# EasyEDA Pro project ProPrj_MambaQuad_2026-04-23.epro, board FC V1 Melted
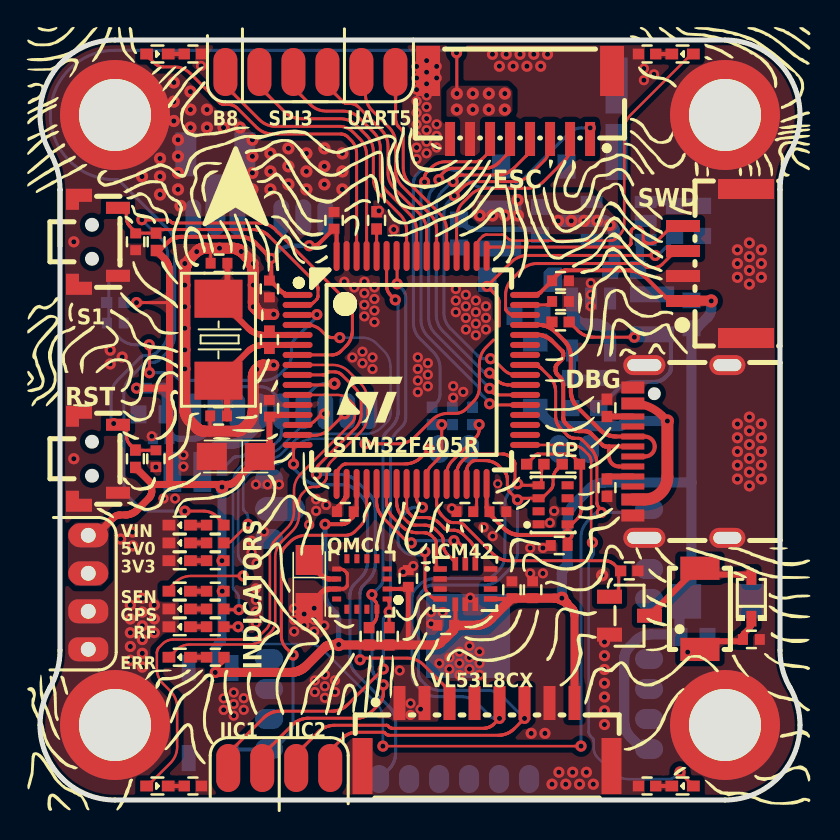
[diagram p14: board, top side]
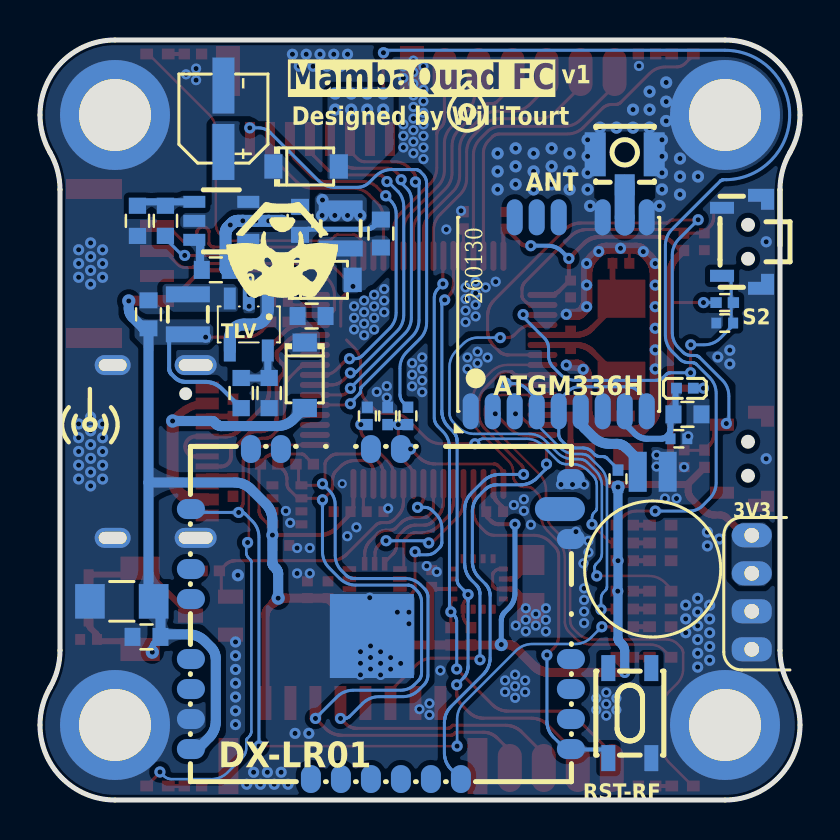
[diagram p15: board, bottom side, seen from below]

Outline 38 x 38 mm; copper layers: Top Layer, Bottom Layer. Coordinates in mm from the lower left corner of the outline.
Outline path: 1,30.52 arc(0.87,31.48) 0.5,32.38 arc(0.13,33.28) 0,34.25 arc(1.1,36.9) 3.75,38 34.25,38 arc(36.9,36.9) 38,34.25 arc(37.87,33.28) 37.5,32.38 arc(37.13,31.48) 37,30.52 37,7.48 arc(37.13,6.52) 37.5,5.62 arc(37.87,4.72) 38,3.75 arc(36.9,1.1) 34.25,0 3.75,0 arc(1.1,1.1) 0,3.75 arc(0.13,4.72) 0.5,5.62 arc(0.87,6.52) 1,7.48 1,30.52 ; 1,30.52 1,27.71
Stack: Top Layer 0.035mm / Dielectric1 1.51mm FR4 er 4.5 / Bottom Layer 0.035mm

## Design rules (mm)
net SWCLK: DP2
net SWDIO: DP2
net USB_DEBUG_DP: DP1
net USB_DEBUG_DM: DP1
spacing copperThickness1oz (default): track to track 0.102, other pairs 0.152 to 0.3
spacing copperThickness2oz: track to track 0.203, other pairs 0.152 to 0.3
track width copperThickness1oz (default): min 0.102, default 0.203, max 2.54
track width copperThickness2oz: min 0.203, default 0.254, max 2.54
differential pair differentialPair (default): width min 0.127, default 0.254, max 2.54; gap min 0.152, default 0.152
net GND uses copperRegion
net 3V3 uses copperRegion
net $1N129 uses copperRegion
net 5V uses copperRegion
net $1N278 uses copperRegion
net VIN uses copperRegion
net $1N122 uses copperRegion
net $1N120 uses copperRegion

## Placement (name value [footprint] x y rotation side)
3V3  -  [LED0402]  6.99 11.97 0 top
5V0  -  [LED0402]  6.99 12.85 0 top
ANT  3GHz  [ANT-SMD_3P-L3.0-W2.6]  8.76 31.52 0 bottom
ATGM336H  ATGM336H-6N-74  [COMM-SMD_18P-L10.1-W9.7-P1.1-TL_L76-LB]  12.06 24.28 90 bottom
BUZ  DET402  [BUZ-SMD_L4.0-W3.0-LS4.5-FD]  33 9.56 90 top
C1  100nF  [C0402]  18.41 11.08 270 top
C2  4.7uF  [CASE-A_3216]  13.46 10.8 270 top
C3  2.2uF  [C0402]  24.63 10.51 270 top
C4  100nF  [C0402]  23.6 10.51 270 top
C5  100nF  [C0603]  32.67 8.16 180 bottom
C6  1uF  [C0402]  5.79 17.06 270 top
C7  100nF  [C0402]  14.7 28.98 270 top
C8  100nF  [C0402]  11.47 25.55 90 top
C9  100nF  [C0402]  26.03 25.96 180 top
C10  100nF  [C0402]  15.27 14.42 0 top
C11  100nF  [C0402]  22.9 14.42 180 top
C12  22pF  [C0402]  8.93 19.2 180 top
C13  22pF  [C0402]  8.95 26.84 180 top
C14  1uF  [CASE-A_3216]  9.79 17.17 180 top
C15  100nF  [C0402]  11.47 19.58 270 top
C16  2.2uF  [C0402]  26.03 24.93 180 top
C17  2.2uF  [C0402]  21.24 14.42 0 top
C18  100nF  [C0402]  25.96 12.73 0 top
C19  100uF  [C1206]  33.91 9.93 180 bottom
C21  10uF  [C0603]  25 28.96 90 bottom
C22  22uF  [C0603]  20.96 28.32 270 bottom
C23  100nF  [C0603]  29.21 26.51 180 bottom
C24  10uF  [CAP-SMD_BD4.0-L4.3-W4.3-LS5.0-FD]  28.83 34.06 90 bottom
C25  4.7uF  [C0603]  24.42 24.2 0 bottom
C26  10uF  [C0603]  32.57 24.28 270 bottom
C27  1uF  [C0402]  4.78 27.91 270 top
C28  1uF  [C0402]  3.76 23.85 0 bottom
C29  100nF  [C0402]  35.57 8.03 180 top
C30  10uF  [C0603]  5.63 19.28 0 bottom
C31  0.22F  [CAP-TH_DMS3R3224]  7.37 16.41 90 bottom
C32  100nF  [C0402]  6.06 18.06 0 bottom
C33  10nF  [C0402]  20.29 8.73 0 top
D1  1N5819W  [SOD-123_L2.7-W1.6-LS3.7-RD]  24.69 31.68 180 bottom
D2  1N5819W  [SOD-123_L2.7-W1.6-LS3.7-RD]  24.76 21.24 270 bottom
D3  1N5819W  [SOD-123_L2.7-W1.6-LS3.7-RD#2]  24 26.01 180 bottom
D4  1N4148WS  [SOD-323_L1.7-W1.3-LS2.5-FD]  35.57 10.11 270 top
DBG  Type-C-TOP_1  [USB-C-SMD_TYPE-C16PIN]  32 17.43 90 top
DX-LR01  DX-LR01-433T22S  [WIRELM-SMD_DX-LR01-433T22S]  20.96 9.3 270 bottom
ERR  -  [LED0402]  6.99 7.14 0 top
ESC  WAFER-SH1.0-8PWB  [CONN-SMD_8P-P1.00_XUNPU_WAFER-SH1.0-8PWB]  24 34.75 180 top
GPS  -  [LED0402]  6.99 9.55 0 top
H2  -  [HDR-TH_6P-P2.54-V-F]  15.62 36.4 0 top
H4  -  [HDR-TH_4P-P2.54-V-F]  2.41 9.42 270 top
ICM42  ICM-42688-P  [LGA-14_L3.0-W2.5-P0.50-TL]  21.27 10.8 0 top
ICP  ICP-10111  [LGA-8_L2.5-W2.0-P0.65_AMP6127]  25.65 14.76 180 top
L1  2.2uH  [IND-SMD_L2.5-W2.0_MHCHL2520]  22.97 28.58 270 bottom
L2  2.2uH  [IND-SMD_L2.5-W2.0_MHCHL2520]  30.61 24.28 270 bottom
L3  BLM15PX121SN1D  [L0402]  5.75 20.59 180 bottom
LF  -  [LED0402]  5.87 37.3 180 top
LR  -  [LED0402]  5.87 0.7 180 top
NOREF  -  [Pad_e2]  34.25 34.25 0 top
NOREF#2  -  [Pad_e3]  34.25 3.75 270 top
NOREF#3  -  [Pad_e4]  3.75 3.75 180 top
NOREF#4  -  [Pad_e1]  3.75 34.25 0 top
NOREF#5  -  [HDR-TH_4P-P2.54-V-F#2]  13.22 1.6 0 top
Q1  AO3400  [SOT-23-3_L2.9-W1.3-P1.90-LS2.4-BL-2]  29.47 9.22 270 top
QMC  QMC5883P  [LGA-16_L3.0-W3.0-P0.50-BL_SQ]  16.09 10.8 90 top
R1  4.7K  [R0402]  16.45 8.19 270 top
R5  10K  [R0402]  17.47 8.19 270 top
R6  10K  [R0402]  21.63 19.2 90 bottom
R7  5.1K  [R0402]  28.35 19.61 90 top
R8  10K  [R0402]  4.77 17.06 270 top
R9  1M  [R0402]  11.47 23.01 270 top
R10  4.7K  [R0402]  26.54 16.79 0 top
R11  4.7K  [R0402]  24.76 16.79 180 top
R12  220K  [R0603]  31.73 28.96 270 bottom
R13  40.2K  [R0603]  33.13 28.96 90 bottom
R14  100K  [R0603]  26.54 20.35 90 bottom
R15  2K  [R0402]  8.76 13.74 180 top
R16  453K  [R0603]  27.94 20.35 270 bottom
R17  590Ω  [R0402]  8.76 12.85 0 top
R18  330Ω  [R0402]  8.76 11.97 180 top
R19  1.5K  [R0402]  26.03 23.9 180 top
R20  UNKNOWN  [R0402]  19.6 19.2 270 bottom
R21  UNKNOWN  [R0402]  20.62 19.2 90 bottom
R22  330Ω  [R0402]  8.76 8.66 180 top
R23  330Ω  [R0402]  30.35 0.7 180 top
R24  330Ω  [R0402]  30.35 37.3 180 top
R25  330Ω  [R0402]  7.65 0.7 0 top
R26  330Ω  [R0402]  7.65 37.3 0 top
R27  330Ω  [R0402]  8.76 7.14 0 top
R28  330Ω  [R0402]  8.76 10.44 0 top
R29  10K  [R0402]  5.81 27.91 90 top
R30  10K  [R0402]  3.76 24.87 180 bottom
R31  10K  [R0402]  29.46 11.46 0 top
R35  10K  [R0402]  16.83 28.98 90 top
R36  0Ω  [R0402]  9.1 16.06 270 bottom
R37  1K  [R0402]  8.76 9.55 180 top
R38  5.1K  [R0402]  28.35 15.62 90 top
RF  -  [LED0402]  6.99 8.66 0 top
RF#2  -  [LED0402]  32.13 37.3 0 top
RR  -  [LED0402]  32.13 0.7 0 top
RST  HX TS24CA-H3.8 160gf  [SW-SMD_TS24CA]  2.92 17.06 90 top
RST-RF  K2-1808SN-A3SW-01  [SW-SMD_4P-L4.2-W3.3-P2.15-LS5.1]  8.51 4.34 270 bottom
S1  HX TS24CA-H3.8 160gf  [SW-SMD_TS24CA]  2.92 27.91 90 top
S2  HX TS24CA-H3.8 160gf  [SW-SMD_TS24CA]  2.92 27.91 270 bottom
SEN  -  [LED0402]  6.99 10.44 0 top
STM32F405R  STM32F405RGT6  [LQFP-64_L10.0-W10.0-P0.50-LS12.0-BL]  18.57 21.5 270 top
SWD  WAFER-GH1.25-4PWB  [CONN-SMD_4P-P1.25_XUNPU_WAFER-GH1.25-4PWB]  33.73 26.82 90 top
TLV  TLV62568DBVR  [SOT-23-5_L3.0-W1.7-P0.95-LS2.8-BR]  27.56 23.78 90 bottom
TPS  TPS563201DDCR  [SOT-23-6_L2.9-W1.6-P0.95-LS2.8-BR]  28.94 28.96 180 bottom
VIN  -  [LED0402]  6.99 13.74 0 top
VL53L8CX  WAFER-GH1.25-8PWB  [CONN-SMD_8P-P1.25_XUNPU-WAFER-GH1.25-8PWB]  22.35 3.27 0 top
X1  8MHz  [CRYSTAL-SMD_L5.0-W3.2]  8.92 23.01 90 top

## Footprints (pads in the part's own frame, mm; a bottom-side part is the same pattern mirrored in y, then rotated)
ANT-SMD_3P-L3.0-W2.6
  rect 1x1.05 smd: 1(0,0.762)
  rect 1.05x2.2 smd: 2(-1.475,-0.762) 3(1.475,-0.762)
BUZ-SMD_L4.0-W3.0-LS4.5-FD
  rect 1.16x1.96 smd: 1(-2.03,0) 2(2.03,0)
C0402
  rect 0.5x0.54 smd: 1(-0.42,0) 2(0.42,0)
C0603
  rect 0.8x0.9 smd: 1(-0.7,0) 2(0.7,0)
C1206
  rect 1.485x1.728 smd: 1(-1.593,0) 2(1.593,0)
CAP-SMD_BD4.0-L4.3-W4.3-LS5.0-FD
  rect 2.8x1.1 smd: 1(-1.661,0) 2(1.661,0)
CAP-TH_DMS3R3224
  rect 2x0.9 smd: 1(-0.002,0.75) 2(0.002,-0.75)
CASE-A_3216
  rect 1.5x1.359 smd: 1(-1.2,0) 2(1.2,0)
COMM-SMD_18P-L10.1-W9.7-P1.1-TL_L76-LB
  custom 1.8x0.8 smd: 1(-4.85,4.4) 2(-4.85,3.3) 3(-4.85,2.2) 4(-4.85,1.1) 5(-4.85,0) 6(-4.85,-1.1) 7(-4.85,-2.2) 8(-4.85,-3.3) 9(-4.85,-4.4) 10(4.85,-4.4) 11(4.85,-3.3) 12(4.85,-2.2) 14(4.85,0) 15(4.85,1.1) 16(4.85,2.2)
CONN-SMD_4P-P1.25_XUNPU_WAFER-GH1.25-4PWB
  rect 0.6x1.7 smd: 1(-1.875,1.575) 2(-0.625,1.575) 3(0.625,1.575) 4(1.875,1.575)
  rect 1x2.8 smd: 5(3.725,-1.575) 6(-3.725,-1.575)
CONN-SMD_8P-P1.00_XUNPU_WAFER-SH1.0-8PWB
  rect 0.5x1.7 smd: 1(-3.5,1.7) 2(-2.5,1.7) 3(-1.5,1.7) 4(-0.5,1.7) 5(0.5,1.7) 6(1.5,1.7) 7(2.5,1.7) 8(3.5,1.7)
  rect 1.2x2.5 smd: 9(4.6,-1.7) 10(-4.6,-1.7)
CONN-SMD_8P-P1.25_XUNPU-WAFER-GH1.25-8PWB
  rect 0.6x1.7 smd: 1(-4.375,1.575) 2(-3.126,1.575) 3(-1.875,1.575) 4(-0.625,1.575) 5(0.625,1.575) 6(1.875,1.575) 7(3.125,1.575) 8(4.375,1.575)
  rect 1x2.8 smd: 10(6.225,-1.575) 11(-6.225,-1.575)
CRYSTAL-SMD_L5.0-W3.2
  rect 1.9x2.4 smd: 1(-2.05,0) 2(2.05,0)
HDR-TH_4P-P2.54-V-F
  oval 1.2x2 hole 0.74: 1(-3.81,0) 2(-1.91,0)
  rrect 1.2x2 hole 0.74: 3(-0.01,0) 4(1.89,0)
HDR-TH_4P-P2.54-V-F#2
  oval 1.2x2.4 smd: 1(-3.81,0) 2(-2.11,0) 3(-0.41,0) 4(1.29,0)
HDR-TH_6P-P2.54-V-F
  oval 1.2x2.4 smd: 1(-6.35,0) 2(-4.65,0) 3(-2.95,0) 4(-1.25,0) 5(0.45,0) 6(2.15,0)
IND-SMD_L2.5-W2.0_MHCHL2520
  rect 0.8x2.2 smd: 1(-1,0) 2(1,0)
L0402
  rect 0.54x0.54 smd: 1(-0.42,0) 2(0.42,0)
LED0402
  rect 0.637x0.541 smd: 1(-0.538,0) 2(0.538,0)
LGA-8_L2.5-W2.0-P0.65_AMP6127
  rect 0.6x0.4 smd: 1(0.725,0.975) 2(0.725,0.325) 3(0.725,-0.325) 4(0.725,-0.975) 5(-0.725,-0.975) 6(-0.725,-0.325) 7(-0.725,0.325) 8(-0.725,0.975)
LGA-14_L3.0-W2.5-P0.50-TL
  rect 0.675x0.28 smd: 1(-1.262,0.75) 2(-1.262,0.25) 3(-1.262,-0.25) 4(-1.262,-0.75) 8(1.262,-0.75) 9(1.262,-0.25) 10(1.262,0.25) 11(1.262,0.75)
  rect 0.28x0.675 smd: 5(-0.5,-1.012) 6(0,-1.012) 7(0.5,-1.012) 12(0.5,1.012) 13(0,1.012) 14(-0.5,1.012)
LGA-16_L3.0-W3.0-P0.50-BL_SQ
  rect 0.25x0.45 smd: 1(-0.75,-1.263) 2(-0.25,-1.263) 3(0.25,-1.263) 4(0.75,-1.263) 9(0.75,1.263) 10(0.25,1.263) 11(-0.25,1.263) 12(-0.75,1.263)
  rect 0.45x0.25 smd: 5(1.263,-0.75) 6(1.263,-0.25) 7(1.263,0.25) 8(1.263,0.75) 13(-1.263,0.75) 14(-1.263,0.25) 15(-1.263,-0.25) 16(-1.263,-0.75)
LQFP-64_L10.0-W10.0-P0.50-LS12.0-BL
  oval 0.3x1.5 smd: 1(-3.75,-5.688) 2(-3.25,-5.688) 3(-2.75,-5.688) 4(-2.25,-5.688) 5(-1.75,-5.688) 6(-1.25,-5.688) 7(-0.75,-5.688) 8(-0.25,-5.688) 9(0.25,-5.688) 10(0.75,-5.688) 11(1.25,-5.688) 12(1.75,-5.688) 13(2.25,-5.688) 14(2.75,-5.688) 15(3.25,-5.688) 16(3.75,-5.688) 33(3.75,5.688) 34(3.25,5.688) 35(2.75,5.688) 36(2.25,5.688) 37(1.75,5.688) 38(1.25,5.688) 39(0.75,5.688) 40(0.25,5.688) 41(-0.25,5.688) 42(-0.75,5.688) 43(-1.25,5.688) 44(-1.75,5.688) 45(-2.25,5.688) 46(-2.75,5.688) 47(-3.25,5.688) 48(-3.75,5.688)
  oval 1.5x0.3 smd: 17(5.7,-3.738) 18(5.7,-3.238) 19(5.7,-2.738) 20(5.7,-2.238) 21(5.7,-1.738) 22(5.7,-1.238) 23(5.7,-0.739) 24(5.7,-0.238) 25(5.7,0.262) 26(5.7,0.762) 27(5.7,1.262) 28(5.7,1.762) 29(5.7,2.261) 30(5.7,2.762) 31(5.7,3.261) 32(5.7,3.762) 49(-5.7,3.762) 50(-5.7,3.261) 51(-5.7,2.762) 52(-5.7,2.261) 53(-5.7,1.762) 54(-5.7,1.262) 55(-5.7,0.762) 56(-5.7,0.262) 57(-5.7,-0.238) 58(-5.7,-0.739) 59(-5.7,-1.238) 60(-5.7,-1.738) 61(-5.7,-2.238) 62(-5.7,-2.738) 63(-5.7,-3.238) 64(-5.7,-3.738)
Pad_e1
  round 5.5 hole 3.6: 1(0,0)
Pad_e2
  round 5.5 hole 3.6: 1(0,0)
Pad_e3
  round 5.5 hole 3.6: 1(0,0)
Pad_e4
  round 5.5 hole 3.6: 1(0,0)
R0402
  rect 0.566x0.54 smd: 1(-0.433,0) 2(0.433,0)
R0603
  rect 0.806x0.864 smd: 1(-0.753,0) 2(0.753,0)
SOD-123_L2.7-W1.6-LS3.7-RD
  rect 0.91x1.22 smd: 1(-1.635,0) 2(1.635,0)
SOD-123_L2.7-W1.6-LS3.7-RD#2
  custom 0.91x1.22 smd: 1(-1.635,0)
  rect 0.91x1.22 smd: 2(1.635,0)
SOD-323_L1.7-W1.3-LS2.5-FD
  rect 0.78x0.5 smd: 1(-1.04,0) 2(1.04,0)
SOT-23-3_L2.9-W1.3-P1.90-LS2.4-BL-2
  rect 0.7x1.25 smd: 1(-0.95,-1) 2(0.95,-1) 3(0,1)
SOT-23-5_L3.0-W1.7-P0.95-LS2.8-BR
  rect 1.1x0.6 smd: 1(1.3,-0.95) 2(1.3,0) 3(1.3,0.95) 4(-1.3,0.95) 5(-1.3,-0.95)
SOT-23-6_L2.9-W1.6-P0.95-LS2.8-BR
  rect 1.1x0.6 smd: 1(1.35,-0.95) 2(1.35,0) 3(1.35,0.95) 4(-1.35,0.95) 5(-1.35,0) 6(-1.35,-0.95)
SW-SMD_4P-L4.2-W3.3-P2.15-LS5.1
  rect 1.3x0.7 smd: 1(-2.25,1.075) 2(2.25,1.075) 3(-2.25,-1.075) 4(2.25,-1.075)
SW-SMD_TS24CA
  custom 1.05x1.3 smd: 1(-2.125,0.975) 2(2.125,0.975)
  rect 0.6x1.2 smd: 3(-1.7,-0.975) 4(1.7,-0.975)
USB-C-SMD_TYPE-C16PIN
  oval 1x2.1 hole 0.6x1.7: 1(-4.32,1.788) 2(4.32,1.788)
  oval 1x1.8 hole 0.6x1.4: 3(-4.32,-2.362) 4(4.32,-2.362)
  rect 0.6x1.15 smd: A1B12(-3.2,2.362) A4B9(-2.4,2.362) B1A12(3.2,2.362) B4A9(2.4,2.362)
  rect 0.3x1.15 smd: A5(-1.25,2.362) A6(-0.25,2.362) A7(0.25,2.362) A8(1.25,2.362) B5(1.75,2.362) B6(0.75,2.362) B7(-0.75,2.362) B8(-1.75,2.362)
WIRELM-SMD_DX-LR01-433T22S
  oval 1.4x1 smd: 2(-8.25,1) 3(-8.25,-0.5) 6(-8.25,-5) 7(-8.25,-6.5) 16(8.25,-3.5) 17(8.25,-2) 18(8.25,-0.5) 19(8.25,1) 20(8.25,2.5) 21(8.25,4)
  oval 1x1.4 smd: 8(-5.25,-9.5) 10(-2.25,-9.5) 11(-0.75,-9.5) 12(2.25,-9.5) 13(3.75,-9.5) 14(5.25,-9.5) 15(6.75,-9.5) 22(6.75,9.5) 23(5.25,9.5) 24(3.75,9.5) 25(2.25,9.5) 28(-3.75,9.5) 30(-6.75,9.5)
  oval 1.2x2.5 smd: 29(-5.25,8.95)
  rect 4.2x4.2 smd: 31(1.1,-0.45)

## Nets
3V3: BUZ.1 C1.2 C3.2 C4.2 C5.2 C7.2 C8.2 C9.2 C10.2 C11.2 C14.1 C15.2 C18.2 C19.2 C26.2 C29.2 C33.2 D4.2 DX-LR01.15 H4.1 H4.2 ICM42.5 ICM42.8 ICP.8 L2.2 L3.2 QMC.2 R1.2 R5.2 R8.2 R10.2 R11.2 R16.2 R18.1 R19.1 R27.2 R28.2 R29.1 R30.1 R36.2 STM32F405R.1 STM32F405R.13 STM32F405R.19 STM32F405R.32 STM32F405R.48 STM32F405R.64 SWD.1 VL53L8CX.8
5V: C22.2 D3.2 L1.2 R12.2 R17.2
5V_USB: D2.2 DBG.A4B9 DBG.B4A9
GND: 3V3.1 5V0.1 ANT.2 ANT.3 ATGM336H.1 ATGM336H.10 ATGM336H.12 C1.1 C2.2 C3.1 C4.1 C5.1 C6.2 C7.1 C8.1 C9.1 C10.1 C11.1 C12.2 C13.2 C14.2 C15.1 C16.1 C17.1 C18.1 C19.1 C21.1 C22.1 C24.2 C25.1 C26.1 C27.2 C28.2 C29.1 C30.1 C31.2 C32.1 C33.1 DBG.1 DBG.2 DBG.3 DBG.4 DBG.A1B12 DBG.B1A12 DX-LR01.14 DX-LR01.28 DX-LR01.30 DX-LR01.31 ESC.8 ESC.9 ESC.10 GPS.1 H4.3 H4.4 ICM42.2 ICM42.3 ICM42.6 ICM42.7 ICM42.10 ICM42.11 ICP.1 ICP.7 NOREF.1 NOREF#2.1 NOREF#3.1 NOREF#4.1 Q1.2 QMC.9 QMC.11 R6.2 R7.2 R13.1 R14.1 R21.2 R23.2 R24.2 R25.2 R26.2 R31.2 R35.2 R38.1 RF.1 RST.1 RST.2 RST.3 RST-RF.2 S1.1 S1.2 S1.3 S2.1 S2.2 S2.3 STM32F405R.12 STM32F405R.18 STM32F405R.63 SWD.2 SWD.5 SWD.6 TLV.2 TPS.1 VIN.1 VL53L8CX.1 VL53L8CX.2 VL53L8CX.7 VL53L8CX.10 VL53L8CX.11
VIN: D1.2 ESC.7 R15.1
ADC1_IN8: R20.2 R21.1 STM32F405R.26
BUZ: Q1.1 R31.1 STM32F405R.27
DSHOT_M1: ESC.6 STM32F405R.37
DSHOT_M2: ESC.5 STM32F405R.38
DSHOT_M3: ESC.4 STM32F405R.39
DSHOT_M4: ESC.3 STM32F405R.40
ESC_CURR: ESC.1 R20.1
ESC_TX: ESC.2 STM32F405R.52
EX_PB8: H2.1 STM32F405R.61
EX_SPI3_MISO: H2.3 STM32F405R.56
EX_SPI3_MOSI: H2.2 STM32F405R.57
EX_SPI3_SCK: H2.4 STM32F405R.55
EX_UART5_RX: H2.5 STM32F405R.54
EX_UART5_TX: H2.6 STM32F405R.53
GPIO_EXTI2: ATGM336H.4 R37.1 STM32F405R.10
GPIO_EXTI5: ICM42.4 STM32F405R.25
GPIO_EXTI8: DX-LR01.8 R22.1 STM32F405R.41
GPIO_EXTI13: C27.1 R29.2 S1.4 STM32F405R.2
GPIO_EXTI14: C28.1 R30.2 S2.4 STM32F405R.3
GPS_RX: ATGM336H.3 STM32F405R.14
GPS_TX: ATGM336H.2 STM32F405R.15
I2C1_SCL: NOREF#5.1 QMC.1 R5.1 STM32F405R.58
I2C1_SDA: NOREF#5.2 QMC.16 R1.1 STM32F405R.59
I2C2_SCL: ICP.4 NOREF#5.3 R11.1 STM32F405R.29 VL53L8CX.5
I2C2_SDA: ICP.3 NOREF#5.4 R10.1 STM32F405R.30 VL53L8CX.6
ICM42688P_CS: ICM42.12 STM32F405R.24
ICM42688P_SCK: ICM42.13 STM32F405R.21
ICM42688P_SDI: ICM42.14 STM32F405R.23
ICM42688P_SDO: ICM42.1 STM32F405R.22
LED_ERR: ERR.1 STM32F405R.8
LED_LF: LF.2 STM32F405R.62
LED_LR: LR.2 STM32F405R.11
LED_RF: RF#2.2 STM32F405R.50
LED_RR: RR.2 STM32F405R.33
LED_STATUS: SEN.1 STM32F405R.4
LORA_RST: DX-LR01.22 RST-RF.4 STM32F405R.20
LORA_RX: DX-LR01.21 STM32F405R.16
LORA_TX: DX-LR01.2 STM32F405R.17
OSC_IN: C13.1 R9.1 STM32F405R.5 X1.2
OSC_OUT: C12.1 R9.2 STM32F405R.6 X1.1
PC1: STM32F405R.9 VL53L8CX.3
RST: C6.1 R8.1 RST.4 STM32F405R.7
SPI2_MISO: STM32F405R.35
SPI2_MOSI: STM32F405R.36
SPI2_SCK: STM32F405R.34
SWCLK: STM32F405R.49 SWD.4
SWDIO: STM32F405R.46 SWD.3
USART1_RX: STM32F405R.43
USART1_TX: STM32F405R.42
USART3_TX: STM32F405R.51
USB_DEBUG_DM: DBG.A7 DBG.B7 STM32F405R.44
USB_DEBUG_DP: DBG.A6 DBG.B6 R19.2 STM32F405R.45
$1N19: C2.1 QMC.10
$1N83: C16.2 STM32F405R.47
$1N84: C17.2 STM32F405R.31
$1N102: R6.1 STM32F405R.28
$1N103: R35.1 STM32F405R.60
$1N118: R12.1 R13.2 TPS.4
$1N120: C21.2 C24.1 D1.1 TPS.3 TPS.5
$1N121: C23.1 TPS.6
$1N122: C23.2 L1.1 TPS.2
$1N125: R15.2 VIN.2
$1N127: R14.2 R16.1 TLV.5
$1N129: L2.1 TLV.3
$1N138: 5V0.2 R17.1
$1N141: 3V3.2 R18.2
$1N278: C25.2 D2.1 D3.1 TLV.1 TLV.4
$1N282: DBG.A5 R38.2
$1N283: DBG.B5 R7.1
$1N318: R22.2 RF.2
$1N356: BUZ.2 D4.1 Q1.3
$1N367: GPS.2 R37.2
$1N371: ANT.1 ATGM336H.11
$1N378: ATGM336H.6 C31.1
$1N390: ATGM336H.5 ATGM336H.9 R36.1
$1N391: ATGM336H.8 C30.2 C32.2 L3.1
$1N445: R28.1 SEN.2
$1N446: ERR.2 R27.1
$1N450: LF.1 R26.1
$1N451: LR.1 R25.1
$1N452: R24.1 RF#2.1
$1N453: R23.1 RR.1

Pads without a net: ATGM336H 7 14 15 16; DBG A8 B8; DX-LR01 3 6 7 10 11 12 13 16 17 18 19 20 23 24 25 29; ICM42 9; ICP 2 5 6; QMC 3 4 5 6 7 8 12 13 14 15; RST-RF 1 3; VL53L8CX 4

## Via types
v1: diameter 0.66, hole 0.254, Top Layer to Bottom Layer, 6 vias
v2: diameter 0.559, hole 0.254, Top Layer to Bottom Layer, 149 vias
v3: diameter 0.61, hole 0.254, Top Layer to Bottom Layer, 60 vias
v4: diameter 0.508, hole 0.254, Top Layer to Bottom Layer, 146 vias
v5: diameter 0.457, hole 0.254, Top Layer to Bottom Layer, 1 via

## Routing (per net, layer and track width the routed paths; a pad name or vN(x,y) marks a point on that pad's centre or on a via; arc(x,y) is an arc through that point)
3V3: length 159.6
  Top Layer w0.152: 8.78,6.51 8.78,6.51 ; 26.34,17.3 26.38,17.29 26.39,17.29 26.43,17.28 26.44,17.28 26.47,17.27 26.52,17.25 26.53,17.25 26.58,17.23 26.6,17.21 26.62,17.2 26.66,17.17 26.68,17.16 ; 24.92,17.3 26.28,17.3 26.32,17.3 ; 26.42,13.78 26.42,13.78 ; 26.61,13.82 26.62,13.82 ; 27.04,16.72 27.04,16.72 ; 26.41,13.78 26.41,13.78 ; 8.76,6.46 8.77,6.47 ; 27.05,14.46 27.05,14.5 27.05,16.68 ; 26.55,13.79 26.56,13.79 ; v2(29.72,23.14) 27.7,23.14 27.61,23.14 27.59,23.15 27.52,23.16 27.5,23.16 27.43,23.17 27.41,23.18 27.35,23.2 27.33,23.2 27.26,23.23 27.24,23.23 27.18,23.26 27.16,23.27 27.1,23.31 27.08,23.32 27.04,23.35 27.02,23.36 27.01,23.37 26.96,23.41 26.94,23.43 26.89,23.48 R19.1 ; 9.18,6.93 9.17,6.92 ; 26.64,13.84 26.65,13.84 ; 24.9,17.3 24.89,17.3 ; 27.05,14.45 27.04,14.41 27.04,14.4 27.03,14.36 27.02,14.31 27.01,14.27 27,14.26 26.99,14.23 26.96,14.18 26.94,14.14 26.93,14.13 26.91,14.11 ; 26.65,13.85 26.87,14.07 26.9,14.1 ; 26.5,13.78 26.51,13.78 ; 9.2,7.02 9.2,7.01 ; 9.19,6.98 9.19,6.97 ; 24.82,17.27 24.81,17.27 ; 27.05,16.7 27.05,16.69 ; 26.43,13.78 26.49,13.78 ; 9.14,6.86 9.13,6.86 ; 6.48,24.86 6.47,24.87 ; 24.69,17.15 24.69,17.15 ; 26.95,16.89 26.73,17.11 26.7,17.14 ; 27.04,16.71 27.05,16.71 ; 8.77,6.48 8.77,6.48 ; 27.05,16.7 27.05,16.7 ; 26.98,16.81 26.98,16.83 ; 8.8,6.53 9.13,6.85 ; 24.79,17.25 24.78,17.25 ; 8.79,6.52 8.8,6.52 ; 27.03,16.73 27.04,16.73 ; 26.38,13.75 26.38,13.75 ; 24.87,17.29 24.86,17.29 ; 26.51,13.78 26.52,13.79 ; 26.96,16.88 26.96,16.88 ; 24.77,17.23 24.69,17.16 ; R27.2 9.2,7.03 ; 8.79,6.51 8.79,6.52 ; 26.39,13.76 26.39,13.76 ; v2(4.83,24.87) 6.47,24.87 ; 24.91,17.3 24.92,17.3 ; 26.4,13.77 26.4,13.77 ; 8.76,6.41 8.76,6.44 ; 9.19,6.96 9.19,6.95 ; 26.98,16.84 26.97,16.84 ; 26.6,13.81 26.61,13.81 ; 24.88,17.3 24.88,17.29 ; 8.76,6.45 8.76,6.46 ; 27.03,16.74 27.03,16.73 ; 26.38,13.75 26.38,13.74 ; 8.78,6.5 8.78,6.5 ; 9.18,6.94 9.18,6.94 ; 24.85,17.29 24.84,17.28 ; 9.19,7 9.19,6.99 ; 9.17,6.91 9.16,6.9 ; 26.4,13.78 26.41,13.78 ; 26.57,13.8 26.57,13.8 ; 24.83,17.28 24.83,17.28 ; 9.15,6.88 9.14,6.87 ; 8.77,6.49 8.78,6.49 ; 8.76,6.44 8.76,6.45 ; 26.53,13.79 26.54,13.79 ; 26.39,13.77 26.39,13.76 ; R11.2 24.68,17.14 ; 27.05,16.69 27.05,16.69 ; 26.99,16.78 27.02,16.75 ; 24.8,17.27 24.8,17.26 ; 27.04,16.72 27.04,16.72 ; 26.58,13.8 26.59,13.81 ; 8.77,6.47 8.77,6.47 ; 24.78,17.25 24.77,17.24 ; 9.16,6.9 9.15,6.89 ; 26.63,13.83 26.64,13.84
  Top Layer w0.196: 25,25.36 25.01,25.37 ; 24.86,25.31 24.87,25.31 ; 24.84,25.31 24.85,25.31 ; 24.65,25.27 24.66,25.27 ; 24.96,25.34 24.97,25.34 ; STM32F405R.48 24.6,25.25 ; 24.61,25.25 24.62,25.25 ; 24.71,25.31 24.82,25.31 ; 24.94,25.33 24.95,25.33 ; 24.92,25.32 24.93,25.32 ; 24.9,25.31 24.91,25.32 ; 24.66,25.28 24.68,25.29 ; 24.88,25.31 24.89,25.31 ; 24.98,25.35 24.99,25.36 ; 25.59,25.94 25.03,25.39 ; 25.02,25.38 25.03,25.38
  Top Layer w0.203: C33.2 20.74,8.76 ; 26.37,13.25 24,13.25 23.91,13.25 23.89,13.26 23.83,13.26 23.8,13.27 23.74,13.28 23.72,13.29 23.65,13.31 23.63,13.31 23.57,13.34 23.55,13.34 23.49,13.37 23.47,13.38 23.41,13.42 23.39,13.43 23.34,13.46 23.31,13.48 23.26,13.52 23.24,13.54 23.19,13.59 22.51,14.26 ; 11.56,26.11 11.56,26.11 ; 18.36,10.6 18.35,10.59 ; 5.91,27.48 5.92,27.48 ; 22.51,14.27 22.51,14.27 ; 5.85,27.48 5.9,27.48 ; 22.33,14.64 22.33,14.65 ; 22.48,14.33 22.48,14.33 ; 22.36,14.55 22.36,14.56 ; 22.34,14.62 22.33,14.63 ; 22.35,14.58 22.34,14.59 ; 11.53,26.03 11.53,26.03 ; 22.38,14.52 22.38,14.53 ; 20.75,8.78 20.75,8.79 ; 18.35,10.59 18.34,10.58 ; 13.71,27.72 13.73,27.72 ; 15.31,13.85 15.33,13.86 ; 15.35,13.87 15.37,13.89 15.4,13.9 ; 15.8,14.54 15.8,14.54 ; 15.79,14.53 15.8,14.53 ; 15.83,14.62 15.83,14.62 ; 15.69,14.38 15.69,14.37 ; 22.33,14.67 STM32F405R.32 ; 15.61,14.12 15.44,13.94 15.41,13.92 ; 15.13,13.79 15.15,13.8 ; 15.71,14.44 15.72,14.45 ; 18.31,10.57 18.31,10.56 ; 14.82,28.53 14.83,28.52 ; 6.02,27.52 6.03,27.52 ; 15.82,14.58 15.82,14.59 ; 5.92,27.48 5.93,27.48 ; 13.7,27.71 13.66,27.71 v2(13.46,27.71) ; 15.24,13.82 15.26,13.83 ; 15.69,14.4 15.69,14.4 ; 15.81,14.55 15.81,14.55 ; 20.76,8.8 20.76,8.8 ; 18.25,10.55 18.25,10.55 ; 14.83,28.5 STM32F405R.64 ; 15.67,14.21 15.67,14.2 ; 11.49,25.97 11.51,25.97 ; 14.82,28.54 14.82,28.53 ; 20.76,8.8 20.76,8.81 ; 18.3,10.56 18.3,10.56 ; 11.54,26.06 11.55,26.06 ; 22.48,14.35 22.48,14.35 ; 22.5,14.28 22.5,14.27 ; 6.05,27.54 6.39,27.88 6.43,27.92 6.45,27.93 6.49,27.97 6.51,27.98 6.55,28.01 6.57,28.02 6.62,28.05 6.63,28.06 6.69,28.08 6.7,28.09 6.75,28.11 6.77,28.11 6.83,28.13 6.84,28.13 6.9,28.14 6.92,28.15 6.97,28.15 6.99,28.15 7.07,28.16 10,28.16 10.08,28.15 10.1,28.15 10.16,28.15 10.18,28.14 10.25,28.13 10.28,28.12 10.34,28.11 10.36,28.1 10.43,28.08 10.45,28.07 10.51,28.04 10.53,28.03 10.59,28 10.61,27.99 10.66,27.95 10.68,27.94 10.73,27.89 10.75,27.88 10.81,27.82 11.25,27.39 11.3,27.33 11.32,27.31 11.34,27.28 11.36,27.25 11.39,27.2 11.41,27.18 11.42,27.17 11.44,27.13 11.45,27.1 11.47,27.06 11.48,27.05 11.5,26.97 11.51,26.95 11.53,26.89 11.53,26.87 11.54,26.81 11.55,26.79 11.55,26.73 11.55,26.71 11.56,26.64 11.56,26.12 ; 20.76,8.82 20.77,8.82 ; 14.26,13.79 15.08,13.79 15.11,13.79 ; 15.69,14.36 15.69,14.3 ; 6.03,27.53 6.04,27.53 ; 22.35,14.57 22.35,14.58 ; 15.66,14.19 15.66,14.18 ; v2(14.25,13.79) 14.26,13.79 ; 14.8,28.56 14.8,28.55 ; 13.85,27.76 13.84,27.75 ; 25.62,26.02 25.87,26.28 25.9,26.31 25.91,26.32 25.95,26.34 25.96,26.35 25.99,26.38 26,26.38 26.05,26.41 26.09,26.43 26.14,26.45 26.16,26.45 26.2,26.46 26.21,26.47 26.25,26.47 26.26,26.48 26.31,26.48 26.32,26.48 26.38,26.48 29.45,26.48 29.53,26.48 29.55,26.48 29.61,26.47 29.63,26.47 29.66,26.47 29.71,26.46 29.73,26.45 29.79,26.43 29.81,26.43 29.88,26.4 29.9,26.4 29.96,26.37 29.98,26.36 30.04,26.33 30.06,26.31 30.11,26.28 30.13,26.26 30.19,26.22 30.2,26.21 30.27,26.15 31.25,25.17 31.28,25.13 31.3,25.12 31.33,25.1 31.34,25.09 31.39,25.06 31.43,25.03 31.44,25.03 31.49,25 31.53,24.99 31.55,24.98 31.59,24.97 31.6,24.97 31.65,24.96 31.66,24.96 31.7,24.95 31.72,24.95 31.77,24.95 31.79,24.95 32.15,24.95 ; 15.63,14.13 15.63,14.14 ; 14.81,28.55 14.81,28.55 ; 15.69,14.29 15.69,14.28 ; 13.91,27.79 13.9,27.78 ; 25.61,25.98 25.61,26 ; 22.48,14.32 22.48,14.32 ; 22.39,14.51 22.39,14.52 ; 22.5,14.28 22.5,14.28 ; 15.66,14.18 15.65,14.17 ; 11.52,26.02 11.52,26.03 ; 11.49,25.99 11.51,26.02 ; 20.76,8.79 20.76,8.79 ; 15.81,14.56 15.82,14.56 ; 13.95,27.82 13.97,27.84 14.67,28.54 ; 22.33,14.65 22.33,14.66 ; 15.82,14.57 15.82,14.57 ; 14.73,28.56 14.76,28.56 ; 22.48,14.31 22.48,14.31 ; 14.77,28.56 14.78,28.56 ; 5.97,27.49 5.98,27.49 ; 15.69,14.39 15.69,14.39 ; 14.78,28.56 14.78,28.56 ; STM32F405R.1 12.54,25.25 12.49,25.25 12.46,25.26 12.41,25.26 12.38,25.27 12.35,25.28 12.31,25.29 12.26,25.31 12.2,25.33 12.16,25.36 12.13,25.38 12.12,25.39 12.08,25.42 12.07,25.42 12.03,25.46 11.53,25.97 ; 15.68,14.23 15.68,14.22 ; 15.28,13.83 15.3,13.84 ; 15.69,14.37 15.69,14.37 ; 15.7,14.41 15.7,14.42 ; ICM42.8 23.56,10.05 ; 15.83,14.63 STM32F405R.19 ; C11.2 22.48,14.36 ; 18.39,10.63 18.36,10.6 ; 22.48,14.34 22.48,14.34 ; 20.77,8.83 ICM42.5 ; 15.21,13.81 15.22,13.81 ; 14.81,28.54 14.82,28.54 ; 15.68,14.25 15.68,14.24 ; 11.53,26.04 11.54,26.04 ; 18.24,10.55 QMC.2 ; v3(26.38,13.25) 26.38,13.25 ; v3(26.38,13.25) 26.38,13.73 ; v3(26.38,13.25) C18.2 ; 15.7,14.42 15.7,14.43 ; 14.79,28.56 14.79,28.56 ; 13.82,27.74 13.81,27.74 ; 18.32,10.57 18.32,10.57 ; 15.83,14.59 15.83,14.6 ; 18.34,10.58 18.33,10.58 ; 15.69,14.41 15.69,14.41 ; 18.28,10.55 18.27,10.55 ; 6.01,27.51 6.02,27.51 ; 22.49,14.29 22.49,14.29 ; 11.55,26.07 11.55,26.07 ; 15.73,14.46 15.78,14.51 ; 6,27.5 6,27.5 ; 20.76,8.81 20.76,8.81 ; 22.48,14.42 22.4,14.5 ; 15.72,14.45 15.72,14.45 ; 13.79,27.73 13.78,27.73 ; 15.17,13.8 15.19,13.8 ; 14.83,28.52 14.83,28.51 ; 20.74,8.77 20.75,8.78 ; 5.94,27.48 5.95,27.48 ; 22.37,14.54 22.37,14.54 ; 13.76,27.72 13.75,27.72 ; 14.72,28.56 14.72,28.56 ; 20.75,8.78 20.75,8.78 ; 22.49,14.3 22.49,14.3 ; 15.83,14.61 15.83,14.61 ; 5.95,27.48 5.96,27.49 ; 22.34,14.6 22.34,14.61 ; 11.55,26.09 11.55,26.09 ; 15.78,14.52 15.79,14.52 ; 15.71,14.43 15.71,14.44 ; 11.54,26.05 11.54,26.05 ; 18.29,10.56 18.28,10.56 ; 15.62,14.13 15.62,14.12 ; 15.68,14.27 15.68,14.26 ; 13.94,27.81 13.92,27.8 ; 15.65,14.16 15.64,14.15 ; 13.88,27.77 13.87,27.76 ; 14.83,28.51 14.83,28.51 ; 18.27,10.55 18.26,10.55 ; 11.55,26.08 11.55,26.08 ; 11.56,26.1 11.56,26.1 ; 5.98,27.49 5.99,27.5 ; 14.68,28.55 14.68,28.54
  Top Layer w0.254: 18.41,10.62 18.41,7.75
  Top Layer w0.299: 11.47,19.14 11.47,19.14 ; 11.62,19.25 STM32F405R.13 ; 11.54,19.23 11.54,19.23 ; 11.57,19.24 11.57,19.25 ; 11.6,19.25 11.6,19.25 ; 11.61,19.25 11.61,19.25 ; 11.59,19.25 11.59,19.25 ; 11.56,19.24 11.56,19.24 ; 11.52,19.22 11.53,19.22 ; C14.1 11.24,17.42 11.26,17.45 11.3,17.49 11.33,17.52 11.34,17.53 11.36,17.57 11.39,17.62 11.41,17.67 11.43,17.73 11.44,17.74 11.45,17.8 11.46,17.84 11.46,17.85 11.47,17.89 11.47,17.91 11.47,17.96 11.47,19.13 ; 11.55,19.23 11.55,19.24 ; 11.58,19.25 11.58,19.25 ; 11.49,19.19 11.52,19.21 ; 11.53,19.22 11.53,19.23
  Top Layer w0.305: 35.16,8.23 35.16,8.24 ; 35.56,8.76 35.55,8.74 ; 35.5,8.62 35.5,8.64 ; 35.16,8.25 35.17,8.26 ; 35.48,8.6 35.49,8.61 ; 35.08,7.96 35.08,7.96 ; 35.15,8.06 35.15,8.17 ; 35.21,8.33 35.21,8.33 ; 35.15,8.2 35.15,8.21 ; D4.2 35.57,8.86 35.57,8.83 ; 33.25,7.78 33.21,7.74 33.21,7.74 BUZ.1 ; 35.01,7.94 35.01,7.94 ; 35.47,8.59 35.45,8.57 35.22,8.34 ; 35,7.94 33.67,7.94 33.63,7.94 ; 35.15,8.22 35.16,8.22 ; 35.13,8.01 35.1,7.98 ; 35.17,8.27 35.17,8.27 ; 35.15,8.05 35.15,8.05 ; 35.51,8.65 35.52,8.67 ; 35.06,7.95 35.05,7.95 ; 35.19,8.31 35.19,8.3 ; 35.03,7.94 35.03,7.94 ; 35.09,7.97 35.09,7.97 ; 33.61,7.94 33.56,7.93 33.52,7.92 33.48,7.91 33.46,7.9 33.43,7.89 33.39,7.87 33.34,7.85 33.33,7.84 33.28,7.81 33.26,7.79 ; 35.07,7.96 35.07,7.96 ; 35.06,7.95 35.06,7.95 ; 35.1,7.98 35.09,7.97 ; 35.57,8.82 35.57,8.81 ; 35.2,8.32 35.2,8.31 ; 35.18,8.28 35.18,8.29 ; 35.55,8.73 35.54,8.71 ; 35.02,7.94 35.02,7.94 ; 35.56,8.79 35.56,8.77 ; 35.04,7.95 35.04,7.94 ; 35.54,8.7 35.53,8.68 ; 35.15,8.18 35.15,8.19
  Top Layer w0.355: 5.53,15.22 5.54,15.24 ; 9.64,15.84 9.61,15.83 9.58,15.82 ; 5.59,15.4 5.58,15.36 5.58,15.34 ; 3.7,14.14 3.72,14.15 ; 5.49,15.15 5.5,15.17 ; 5.84,27.44 6.19,27.09 6.23,27.05 6.24,27.03 6.28,26.99 6.29,26.97 6.32,26.92 6.33,26.91 6.36,26.86 6.37,26.84 6.4,26.79 6.4,26.77 6.42,26.72 6.43,26.7 6.45,26.64 6.45,26.62 6.46,26.57 6.47,26.55 6.47,26.49 6.47,26.47 6.48,26.39 6.48,20.6 ; 2.89,13.34 2.91,13.36 3.67,14.11 3.69,14.13 ; 6.48,15.78 9.12,15.78 ; 6.48,15.78 5.63,15.78 ; 6.48,15.78 6.48,20.6 ; 9.12,15.78 9.11,15.76 ; 9.12,15.78 9.38,15.78 9.41,15.78 ; 3.86,14.23 3.88,14.23 ; 9.66,15.86 9.68,15.87 9.71,15.89 ; 2.84,13.3 2.85,13.31 ; 2.69,13.24 2.71,13.24 ; 2.72,13.25 2.74,13.25 ; 2.66,13.24 2.67,13.24 ; 9.43,15.78 9.45,15.78 ; 3.76,14.18 3.78,14.19 ; 9.72,15.9 9.75,15.93 C14.1 ; 5.63,15.78 5.61,15.75 ; 5.63,15.78 4.77,16.63 ; 3.9,14.24 3.92,14.24 ; 6.48,20.6 6.47,20.6 ; 5.47,15.12 5.48,15.13 ; 3.79,14.2 3.81,14.21 ; 5.46,15.11 5.43,15.08 4.86,14.51 4.81,14.46 4.77,14.42 4.75,14.41 4.71,14.39 4.7,14.38 4.65,14.35 4.64,14.34 4.59,14.32 4.57,14.32 4.53,14.3 4.51,14.29 4.46,14.28 4.44,14.27 4.4,14.26 4.38,14.26 4.33,14.25 4.31,14.25 4.25,14.25 4,14.25 3.97,14.25 ; 5.57,15.31 5.56,15.28 5.55,15.26 ; 2.78,13.27 2.8,13.28 ; H4.1 2.62,13.23 2.65,13.24 ; 3.83,14.22 3.85,14.22 ; 9.47,15.78 9.49,15.79 ; 5.59,15.71 5.59,15.45 5.59,15.41 ; 9.55,15.8 9.57,15.81 ; 3.73,14.16 3.75,14.17 ; 9.51,15.79 9.53,15.8 ; v1(9.1,15.65) 9.1,15.74 ; 2.75,13.26 2.77,13.26 ; 3.94,14.25 3.96,14.25 ; 5.51,15.18 5.53,15.2 ; 2.87,13.32 2.88,13.33 ; 2.81,13.28 2.83,13.29 ; v2(4.83,20.59) 6.46,20.59
  Top Layer w0.406: 26.73,9.27 26.73,9.23 VL53L8CX.8 ; 26.36,9.82 26.38,9.81 26.57,9.62 26.59,9.59 ; 26.6,9.58 26.62,9.55 26.63,9.54 26.65,9.52 26.65,9.51 26.67,9.48 26.68,9.44 26.7,9.4 26.71,9.37 ; 26.71,9.35 26.72,9.32 26.72,9.29
  Top Layer w0.457: 19.74,7.75 19.71,7.75 18.41,7.75 R5.2 R1.2 14.97,7.75 ; 20.04,7.88 20.06,7.9 20.24,8.07 ; 23.58,10.07 23.56,10.05 22.58,9.07 22.51,9.01 22.49,9 22.44,8.95 22.42,8.94 22.37,8.91 22.35,8.89 22.29,8.86 22.27,8.85 22.21,8.82 22.19,8.81 22.12,8.79 22.1,8.78 22.04,8.77 22.01,8.76 21.94,8.75 21.92,8.74 21.86,8.74 21.84,8.74 21.76,8.73 C33.2 20.71,8.62 ; 14.94,7.77 14.95,7.76 ; 20.64,8.44 20.28,8.09 ; 19.91,7.79 19.93,7.8 ; 20.68,8.5 20.67,8.49 ; 14.25,7.64 14.28,7.66 14.31,7.68 14.32,7.69 14.36,7.71 14.39,7.72 14.4,7.73 14.44,7.75 14.49,7.76 14.52,7.77 14.54,7.77 14.57,7.77 ; 20.71,8.61 20.71,8.6 ; 14.59,7.77 14.62,7.77 14.65,7.77 14.93,7.77 ; 19.84,7.77 19.85,7.77 ; 26.36,9.82 26.32,9.86 26.26,9.9 26.24,9.92 26.21,9.94 26.19,9.95 26.18,9.96 26.14,9.98 26.11,9.99 26.06,10.02 25.99,10.04 25.98,10.05 25.92,10.06 25.9,10.07 25.84,10.08 25.83,10.08 25.77,10.09 25.75,10.09 25.68,10.09 C3.2 23.62,10.09 ; 20.69,8.54 20.69,8.53 ; 19.98,7.83 20,7.85 20.03,7.86 ; 20.7,8.57 20.7,8.56 ; 20.7,8.55 20.7,8.55 ; 20.71,8.59 20.7,8.58 ; 19.87,7.78 19.89,7.79 ; 20.67,8.49 20.66,8.48 ; 14.23,7.63 14.2,7.6 13.32,6.72 13.25,6.66 13.24,6.64 13.18,6.6 13.17,6.59 13.11,6.55 13.09,6.54 13.03,6.5 13.01,6.49 12.95,6.47 12.93,6.46 12.87,6.44 12.85,6.43 12.78,6.41 12.76,6.41 12.71,6.4 12.69,6.39 12.67,6.39 12.6,6.38 12.58,6.38 12.5,6.38 8.79,6.38 ; 20.66,8.47 20.65,8.46 ; 20.69,8.52 20.68,8.51 ; 19.8,7.76 19.82,7.76 ; 19.76,7.75 19.78,7.76 ; 19.94,7.81 19.96,7.82 ; 20.26,8.08 20.27,8.08 ; 20.65,8.46 20.64,8.45
  Top Layer w0.508: 32.16,24.96 32.15,24.95 ; v1(33.56,24.95) 33.56,24.96 ; 32.17,24.96 33.54,24.96
  Bottom Layer w0.152: R30.1 v2(4.83,24.87)
  Bottom Layer w0.203: v2(13.46,27.71) 12.62,27.71 ; R16.2 28.9,20.56 ; 31.03,20.97 31.05,20.98 ; 31.52,21.43 31.52,21.45 ; 31.49,21.37 31.49,21.39 ; 29.7,20.91 29.66,20.9 ; 29.75,20.91 30.69,20.91 ; 31.19,21.07 31.21,21.08 ; 31.14,21.03 31.16,21.04 ; 29.01,20.65 29.03,20.67 ; 29.31,20.83 29.35,20.84 ; 31.28,21.15 31.41,21.28 ; 30.97,20.95 31,20.96 ; 31.5,21.4 31.51,21.42 ; 31.54,22.89 31.54,22.91 ; 12.57,27.71 12.54,27.71 ; 30.74,20.91 30.76,20.91 ; 31.53,21.47 31.53,21.48 ; 31.54,21.6 31.54,22.83 ; 31.49,23.07 31.47,23.09 ; 29.23,20.79 29.26,20.81 ; 31.41,23.17 31.39,23.19 ; 11.98,27.49 12,27.51 ; 31.09,21 31.11,21.01 ; 31.47,21.35 31.48,21.36 ; 31.23,23.27 31.2,23.28 ; 31.53,22.94 31.53,22.97 ; v2(11.56,27.08) 11.89,27.41 ; 29.08,20.7 29.1,20.72 ; 11.92,27.44 11.94,27.46 ; 12.18,27.62 12.2,27.63 ; 31.53,21.5 31.54,21.51 ; 30.86,20.92 30.88,20.92 ; 31.25,21.12 31.23,21.1 ; 31.35,23.21 31.33,23.23 ; 12.04,27.54 12.07,27.56 ; 30.92,20.93 30.94,20.94 ; 31.43,21.3 31.44,21.3 ; 29.57,20.89 29.61,20.9 ; 31.45,23.13 31.43,23.14 ; 31.45,21.32 31.46,21.33 ; 30.8,20.91 30.82,20.91 ; 31.54,21.53 31.54,21.55 ; 12.25,27.65 12.27,27.66 ; 31.15,23.28 31.17,23.28 ; 29.15,20.75 29.18,20.77 ; 29.49,20.88 29.52,20.89 ; 28.93,20.59 28.96,20.61 ; 31.51,23.01 31.51,23.04 ; 12.32,27.67 12.35,27.68 ; 29.4,20.86 29.43,20.87 ; 31.29,23.25 31.27,23.26 ; 12.11,27.58 12.13,27.6 ; 12.39,27.69 12.42,27.7 ; 31.54,21.57 31.54,21.56 ; 12.47,27.7 12.5,27.71
  Bottom Layer w0.254: 14.54,9.61 14.52,9.64 ; 14.91,9.15 14.92,9.13 ; 14.58,9.58 14.75,9.4 ; 14.47,9.7 14.49,9.68 ; 14.9,9.19 14.9,9.17 ; v2(14.25,13.79) 14.25,10.36 ; 14.88,9.23 14.89,9.22 ; 14.25,10.32 14.26,10.28 ; 14.83,9.31 14.84,9.3 ; 14.94,9 14.93,9.02 ; 14.93,9.06 14.93,9.04 ; 14.78,9.38 14.79,9.36 ; 14.38,9.84 14.4,9.81 ; 14.31,9.99 14.32,9.96 ; 14.29,10.07 14.3,10.04 ; 14.27,10.15 14.28,10.12 ; 14.42,9.77 14.44,9.74 ; 14.34,9.91 14.36,9.89 ; 14.86,9.27 14.87,9.26 ; v1(14.94,7.77) 14.94,8.96 ; 14.8,9.35 14.82,9.33 ; 14.92,9.1 14.93,9.09 ; 14.26,10.23 14.26,10.2
  Bottom Layer w0.305: 32.38,7.6 32.38,7.61 ; 32.38,7.67 32.38,7.66 ; 32.28,7.85 32.29,7.84 ; 32.35,7.75 32.35,7.74 ; v1(32.38,7.39) 32.38,7.57 ; 32.38,7.64 32.38,7.62 ; 32.37,7.69 32.37,7.68 ; C5.2 32.26,7.86 ; 32.3,7.83 32.31,7.82 ; 32.33,7.78 32.34,7.77 ; 32.36,7.72 32.36,7.71 ; 32.32,7.8 32.32,7.79 ; L3.2 v2(4.83,20.59)
  Bottom Layer w0.406: L2.2 31.09,23.28 ; 30.28,2.55 DX-LR01.15
  Bottom Layer w0.457: 9.02,7.91 9.03,7.91 ; 9.04,7.92 9.04,7.93 ; 8.76,7.45 8.77,7.47 ; 9.07,7.98 9.08,7.99 ; 8.93,7.81 9.01,7.89 ; 8.85,7.71 8.86,7.73 ; 8.77,7.53 8.78,7.54 ; 8.81,7.64 8.81,7.66 ; 8.9,7.79 8.89,7.78 ; 8.78,7.57 8.79,7.58 ; 9.09,8.04 9.09,8.05 ; 9.05,7.94 9.05,7.95 ; 9.08,8 9.08,8.01 ; 8.79,7.61 8.8,7.62 ; v1(9.1,15.65) 9.1,8.11 ; 9.1,8.09 9.1,8.08 ; 9.1,8.06 9.1,8.07 ; 9.06,7.96 9.07,7.97 ; v2(8.76,6.38) 8.76,7.42 ; 8.83,7.68 8.83,7.69 ; 9.09,8.02 9.09,8.03 ; 8.77,7.48 8.77,7.5 ; 8.87,7.75 8.88,7.76
  Bottom Layer w0.508: 29.22,3.78 29.22,3.81 ; 32.57,15.88 28.28,15.88 ; 32.57,15.88 32.57,23.46 ; 32.57,15.88 32.57,10.37 ; 31.86,8.26 31.86,8.26 ; 32.04,9.62 32.04,9.64 ; 32.83,23.6 32.83,23.6 ; 31.77,8.28 31.78,8.28 ; 29.24,3.69 29.23,3.72 ; 30.28,8.24 30.25,8.23 ; 31.76,8.28 30.59,8.28 ; 32.88,23.63 33.34,24.1 ; 26.11,11.4 26.11,11.41 ; 32.58,23.52 32.58,23.51 ; 27.64,15.69 27.61,15.67 ; 31.84,8.27 31.83,8.27 ; 32.58,23.5 32.58,23.49 ; 26.38,11.83 26.38,11.83 ; 32.45,10.06 C19.2 32.14,9.76 ; 30.08,2.59 30.08,2.58 ; 30.14,2.56 30.15,2.55 ; 33.44,24.21 33.45,24.23 ; 32.5,10.13 32.51,10.14 ; 26.56,14.61 26.58,14.64 ; 26.42,14.29 26.43,14.32 ; 33.56,24.51 33.56,24.53 ; 32.48,10.1 32.49,10.11 ; 27.88,15.81 27.85,15.8 ; 33.38,24.13 33.39,24.15 ; 31.81,8.28 31.8,8.28 ; 29.32,3.44 29.31,3.47 ; 26.13,11.47 26.14,11.48 ; 26.61,14.69 26.64,14.72 ; 29.27,7.35 29.26,7.32 ; 32.77,23.58 32.77,23.58 ; 31.88,8.25 31.87,8.25 ; 26.31,11.69 26.32,11.7 ; 29.95,8.1 29.92,8.08 ; 29.29,7.41 29.28,7.39 ; 32.78,23.58 32.78,23.59 ; 26.38,11.87 v3(26.38,13.25) 26.38,13.97 ; v1(33.56,24.95) 33.56,24.63 ; 27.97,15.84 27.94,15.83 ; 30.16,2.55 30.16,2.55 ; 26.38,14.02 26.38,14.05 ; 32.87,23.62 32.87,23.62 ; 32.55,10.21 32.55,10.22 ; 30.06,2.61 29.56,3.11 ; 26.35,11.74 26.35,11.74 ; 29.36,7.52 29.35,7.5 ; 32.79,23.59 32.8,23.59 ; 26.73,14.82 27.44,15.53 ; 26.37,11.81 26.38,11.81 ; 29.36,3.36 29.35,3.39 ; 33.53,24.41 33.54,24.43 ; 30.03,8.14 30,8.13 ; 29.41,3.28 29.39,3.31 ; 29.78,7.96 29.81,7.99 ; 32.6,23.55 32.6,23.54 ; 26.39,14.11 26.39,14.15 ; 29.75,7.93 29.48,7.66 ; 27.57,15.64 27.54,15.62 ; 32.12,9.73 32.11,9.72 ; 26.23,11.61 26.3,11.68 ; 32.06,9.66 32.07,9.67 ; 32.02,9.59 32.03,9.6 ; 31.89,8.24 31.88,8.24 ; 26.1,11.37 26.1,11.38 ; 26.7,14.79 26.67,14.76 ; 30.11,8.18 30.08,8.17 ; 33.56,24.58 33.56,24.56 ; 33.55,24.46 33.55,24.48 ; 29.23,7.22 29.22,7.19 ; 26.4,14.2 26.41,14.23 ; 27.72,15.74 27.69,15.72 ; 30.37,8.26 30.33,8.26 ; 30.55,8.28 30.51,8.28 ; 26.09,11.33 26.1,11.34 ; 32.67,23.58 32.66,23.58 ; 32.57,10.34 32.57,10.33 ; 29.21,3.91 29.21,3.87 ; 27.47,15.56 27.5,15.58 ; 32.53,10.18 32.54,10.19 ; 28.14,15.87 28.11,15.87 ; 26.16,11.53 26.17,11.54 ; 29.44,7.63 29.43,7.61 ; 32.47,10.08 32.47,10.09 ; 32.65,23.58 32.64,23.57 ; 26.12,11.43 26.12,11.45 ; 32.84,23.6 32.84,23.6 ; 32.8,23.59 32.81,23.59 ; 32.68,23.58 32.68,23.58 ; 29.21,7.06 29.21,7.09 ; 31.82,8.27 31.82,8.28 ; 30.07,2.6 30.07,2.59 ; 32.62,23.56 32.61,23.55 ; 26.09,11.3 26.09,11.31 ; 30.19,2.55 30.18,2.55 ; 26.36,11.77 26.37,11.78 ; 32.7,23.58 32.76,23.58 ; 30.13,2.56 30.13,2.56 ; 26.18,11.56 26.19,11.57 ; 31.79,8.28 31.78,8.28 ; 31.99,9.51 32,9.52 ; 32.56,10.24 32.56,10.25 ; 31.85,8.26 31.84,8.27 ; 26.32,11.7 26.33,11.71 ; 31.98,9.42 31.98,9.44 ; 33.47,24.26 33.48,24.28 ; 30.12,2.57 30.12,2.56 ; 26.34,11.72 26.34,11.73 ; 27.8,15.78 27.77,15.76 ; 32.82,23.59 32.82,23.59 ; 26.15,11.5 26.15,11.51 ; 32.57,23.48 32.57,23.48 ; v1(26.09,10.09) 26.09,11.27 ; 32.85,23.61 32.85,23.61 ; 28.24,15.88 28.2,15.88 ; 32.08,9.69 32.09,9.71 ; 31.97,9.39 31.97,9.4 ; 29.21,3.95 29.21,7.02 ; 29.22,7.15 29.22,7.13 ; 33.41,24.17 33.42,24.18 ; 29.25,7.28 29.24,7.26 ; 30.17,2.55 30.18,2.55 ; 30.09,2.58 30.09,2.58 ; 26.48,14.46 26.49,14.49 ; 32.86,23.62 32.86,23.62 ; 32.59,23.53 32.59,23.53 ; 29.26,3.6 29.25,3.64 ; 29.4,7.58 29.39,7.56 ; 26.21,11.59 26.2,11.58 ; 26.37,11.79 26.37,11.8 ; 32.52,10.16 32.53,10.17 ; 29.29,3.52 29.28,3.55 ; 31.98,9.47 31.99,9.48 ; 29.53,3.14 29.5,3.17 ; 31.97,9.35 C5.2 31.91,8.22 ; 29.47,3.21 29.44,3.24 ; 29.33,7.47 29.31,7.44 ; 32.57,10.3 32.57,10.32 ; 30.28,2.55 30.2,2.55 ; 26.35,11.75 26.36,11.76 ; 32.63,23.57 32.63,23.56 ; 30.45,8.28 30.42,8.27 ; 30.19,8.22 30.16,8.2 ; 29.88,8.05 29.85,8.03 ; 32.56,10.27 32.57,10.28 ; 26.44,14.37 26.46,14.41 ; 32,9.55 32.01,9.56 ; 33.49,24.31 33.5,24.32 ; 31.9,8.23 31.9,8.23 ; 33.52,24.36 33.52,24.37 ; 28.06,15.86 28.02,15.85 ; 26.38,11.85 26.38,11.84 ; 26.52,14.54 26.53,14.57 ; 30.1,2.57 30.11,2.57
  vias: v2(9.1,11.97) v2(9.11,10.44)
5V: length 26
  Top Layer w0.127: 9.36,12.85 9.36,12.85 ; 9.47,12.88 9.47,12.88 ; 9.45,12.87 9.44,12.87 ; v2(10.4,13.79) 9.56,12.95 ; 9.41,12.86 9.4,12.86 ; 9.53,12.92 9.53,12.92 ; 9.55,12.93 9.54,12.93 ; R17.2 9.34,12.85 ; 9.5,12.89 9.49,12.89 ; 9.39,12.86 9.38,12.86 ; 9.51,12.91 9.51,12.9 ; 9.43,12.87 9.42,12.86
  Top Layer w0.152: 22.53,25.78 22.52,25.76 ; 20.42,19.33 20.75,19.33 ; 24.13,27.2 24.17,27.21 ; 21.31,19.56 21.65,19.9 ; 24.22,27.22 24.26,27.22 ; 22.11,22.37 22.13,22.4 ; 22.26,22.59 22.29,22.62 ; 22.92,25.07 22.91,25.08 ; 19.71,19.1 19.68,19.07 ; 18.4,17.91 18.43,17.92 ; v2(16.26,17.81) 17.91,17.81 ; 21.97,21.85 21.97,21.88 ; 23.8,27.07 23.83,27.09 ; 23.58,26.91 23.61,26.93 ; 18.14,17.83 18.17,17.84 ; v2(30.77,27.23) 24.4,27.23 ; 21.96,20.51 21.97,20.54 ; 21.68,19.93 21.71,19.96 ; 21.87,20.2 21.88,20.23 ; 20.11,19.29 20.07,19.28 ; 21.07,19.39 21.09,19.4 ; 22.96,24.85 22.96,23.7 ; 19.61,19.01 19.64,19.04 ; 22.01,22.12 22.02,22.15 ; 23.72,27.02 23.75,27.04 ; 20.91,19.34 20.93,19.35 ; 22.58,25.9 22.57,25.87 ; 21.95,20.43 21.95,20.46 ; 21.18,19.45 21.2,19.46 ; 21.97,20.67 21.97,21.8 ; 22.82,25.21 22.83,25.2 ; 19.94,19.23 19.91,19.22 ; 21.13,19.42 21.15,19.43 ; 20.02,19.27 19.99,19.25 ; 22.96,24.92 22.96,24.93 ; 21.79,20.06 21.81,20.09 ; 22.51,25.66 22.52,25.64 ; 22.88,25.14 22.87,25.15 ; 20.28,19.32 20.25,19.32 ; 23.55,26.88 22.65,25.97 ; 19.58,18.98 18.76,18.16 ; 17.96,17.81 17.99,17.81 ; 22.65,25.39 22.8,25.23 ; 23.96,27.15 23.99,27.16 ; 22.55,25.84 22.54,25.82 ; 21.74,20 21.76,20.02 ; 19.78,19.15 19.75,19.13 ; 21.98,21.94 21.98,21.98 ; 22.86,25.17 22.84,25.18 ; 24.35,27.23 24.31,27.23 ; 21.02,19.37 21.04,19.38 ; 18.23,17.85 18.26,17.86 ; 18.48,17.95 18.51,17.97 ; 21.22,19.48 21.24,19.5 ; 20.19,19.31 20.16,19.31 ; 22.56,25.49 22.58,25.47 ; 22.61,25.93 22.6,25.92 ; 18.72,18.13 18.7,18.1 ; 22.95,24.95 22.95,24.97 ; 20.97,19.36 20.99,19.36 ; 21.93,20.35 21.94,20.38 ; 22.07,22.29 22.08,22.32 ; 21.83,20.13 21.85,20.16 ; 21.99,22.03 22,22.06 ; 22.96,24.88 22.96,24.87 ; 22.94,24.99 22.94,25.01 ; 18.31,17.88 18.34,17.89 ; 20.38,19.33 20.34,19.33 ; 18.05,17.82 18.09,17.82 ; 21.9,20.28 21.91,20.31 ; 22.54,25.54 22.55,25.52 ; 22.52,25.72 22.51,25.7 ; 22.32,22.65 22.67,23 ; 18.55,18 18.58,18.01 ; 19.86,19.19 19.83,19.18 ; 22.9,25.1 22.89,25.12 ; 24.05,27.18 24.08,27.19 ; 22.16,22.44 22.17,22.47 ; 23.65,26.97 23.68,26.99 ; 20.85,19.33 20.87,19.34 ; 22.21,22.52 22.23,22.54 ; 22.04,22.2 22.05,22.24 ; 22.93,25.03 22.93,25.04 ; 20.8,19.33 20.82,19.33 ; 18.63,18.05 18.65,18.07 ; 23.88,27.11 23.91,27.13 ; 22.61,25.43 22.6,25.44 ; 21.28,19.53 21.27,19.52 ; 22.52,25.6 22.53,25.58 ; 21.97,20.62 21.97,20.59
  Bottom Layer w0.127: 10.21,14.45 10.21,14.45 ; v2(16.26,17.81) 16.13,17.94 ; 10.2,14.47 10.19,14.48 ; 15.92,18.05 15.93,18.05 ; 13.44,18.03 13.48,18.04 ; 12.89,17.74 12.92,17.77 ; 13.66,18.06 13.62,18.06 ; 16.11,17.96 16.1,17.96 ; 15.94,18.05 15.96,18.05 ; 10.4,14.12 10.4,14.13 ; 10.28,14.38 10.22,14.44 ; 10.28,16.13 10.27,16.11 ; 10.32,14.34 10.32,14.35 ; 10.18,14.5 10.18,14.51 ; 10.39,14.21 10.39,14.22 ; 13.11,17.91 13.14,17.92 ; 10.3,14.36 10.31,14.36 ; 16,18.03 16.01,18.02 ; 12.13,16.98 12.86,17.71 ; 10.83,16.64 10.85,16.66 ; 10.38,14.23 10.38,14.24 ; 10.98,16.72 11.01,16.73 ; 11.97,16.86 11.99,16.87 ; 13.03,17.86 13.06,17.88 ; 10.4,14.15 10.4,14.16 ; 10.16,14.55 10.16,14.55 ; 10.19,14.49 10.18,14.49 ; 15.86,18.06 15.87,18.06 ; 10.31,16.18 10.3,16.16 ; 11.4,16.79 11.66,16.79 ; 10.39,14.18 10.39,14.19 ; 10.16,14.58 10.16,14.58 ; 13.7,18.06 15.83,18.06 ; 10.62,16.48 10.64,16.51 ; 10.19,15.94 10.18,15.92 ; 10.18,15.89 10.17,15.87 ; 10.75,16.59 10.78,16.61 ; 10.34,16.21 10.33,16.2 ; 11.06,16.74 11.1,16.75 ; 13.35,18.01 13.39,18.02 ; v2(10.4,13.79) 10.4,14.1 ; 10.36,14.29 10.35,14.3 ; 16.08,17.98 16.09,17.97 ; 12.96,17.81 12.99,17.83 ; 11.71,16.79 11.72,16.79 ; 11.93,16.84 11.95,16.85 ; 10.21,14.46 10.2,14.47 ; 11.8,16.8 11.81,16.81 ; 13.53,18.05 13.56,18.05 ; 12.06,16.92 12.07,16.93 ; 12.02,16.89 12.03,16.9 ; 13.19,17.95 13.22,17.96 ; 12.1,16.95 12.09,16.94 ; 11.36,16.79 11.32,16.79 ; 10.23,16.04 10.22,16.02 ; 10.34,14.31 10.34,14.32 ; 13.27,17.98 13.3,18 ; 10.17,15.84 10.16,15.82 ; 10.21,15.99 10.2,15.97 ; 10.58,16.45 10.37,16.24 ; 11.75,16.79 11.77,16.8 ; 16.06,18 16.06,17.99 ; 11.23,16.78 11.27,16.78 ; 15.88,18.06 15.9,18.06 ; 10.69,16.54 10.71,16.56 ; 10.17,14.52 10.17,14.52 ; 11.89,16.83 11.91,16.83 ; 10.16,14.56 10.16,14.57 ; 15.97,18.04 15.99,18.03 ; 10.37,14.26 10.36,14.27 ; 10.16,15.73 10.16,14.6 ; 10.16,15.77 10.16,15.79 ; 11.84,16.81 11.86,16.82 ; 10.17,14.53 10.17,14.54 ; 16.03,18.01 16.04,18.01 ; 11.15,16.77 11.18,16.77 ; 10.25,16.09 10.24,16.07 ; 10.9,16.68 10.93,16.7
  Bottom Layer w0.152: 30.87,27.24 30.88,27.24 ; 30.86,27.23 30.87,27.23 ; 31.72,28.1 31.72,28.09 ; 30.84,27.23 30.85,27.23 ; 31.69,28.04 31.69,28.04 ; 30.89,27.24 30.9,27.25 ; 31.72,28.08 31.72,28.07 ; 30.93,27.27 31.68,28.03 ; 31.71,28.06 31.7,28.05 ; 31.73,28.12 31.73,28.11 ; 30.84,27.23 30.84,27.23 ; v2(30.77,27.23) 30.83,27.23 ; 31.71,28.06 31.71,28.06 ; 30.9,27.25 30.9,27.25 ; 31.7,28.05 31.7,28.04 ; 31.73,28.13 31.73,28.12 ; 30.92,27.26 30.92,27.26 ; R12.2 31.73,28.14 ; 30.85,27.23 30.86,27.23 ; 30.88,27.24 30.89,27.24 ; 31.72,28.09 31.72,28.08 ; 30.91,27.25 30.91,27.26 ; 31.73,28.11 31.73,28.1
  vias: v2(22.35,25.68)
5V_USB: length 13
  Top Layer w0.406: 31.27,19.04 31.28,19.03 ; 31.24,19.08 31.09,19.22 arc(30.43,19.67) DBG.B4A9 ; 31.29,19.01 31.3,19 ; 31.37,18.79 31.37,18.8 ; 31.34,18.93 31.34,18.92 ; 31.35,18.9 31.35,18.88 ; 31.31,18.99 31.32,18.98 ; 31.36,18.86 31.36,18.85 ; 31.33,18.96 31.33,18.95 ; 31.26,19.06 31.26,19.06 ; 31.37,18.83 31.37,18.82
  Top Layer w0.6: DBG.A4B9 30.24,15.03 arc(31.04,15.36) 31.37,16.16 31.37,18.76
  Bottom Layer w0.508: 26.12,18.7 26.08,18.7 ; 28.97,18.7 28.96,18.7 ; 25.57,18.85 25.6,18.83 ; 29.42,18.95 29.41,18.95 ; 25.82,18.74 25.85,18.73 ; 29.3,18.91 29.31,18.92 ; 29.03,18.71 29.02,18.71 ; 29.28,18.89 29.28,18.9 ; 29.36,18.94 29.37,18.94 ; D2.2 25.32,19.05 ; 29.12,18.75 29.11,18.74 ; v1(31.37,18.95) 29.43,18.95 ; 25.65,18.81 25.68,18.79 ; 29.19,18.8 29.18,18.79 ; 29.35,18.94 29.35,18.94 ; 29.09,18.73 29.08,18.73 ; 25.73,18.77 25.76,18.76 ; 29.06,18.72 29.05,18.72 ; 29.38,18.94 29.39,18.95 ; 25.35,19.02 25.38,18.99 ; 25.9,18.72 25.94,18.72 ; 26.17,18.7 28.91,18.7 ; 29.17,18.78 29.16,18.78 ; 29.21,18.82 29.27,18.88 ; 29.29,18.9 29.3,18.91 ; 25.43,18.95 25.45,18.93 ; 29,18.7 28.99,18.7 ; 25.49,18.9 25.52,18.88 ; 29.14,18.77 29.13,18.76 ; 29.33,18.93 29.34,18.93 ; 29.32,18.92 29.32,18.92 ; 28.94,18.7 28.94,18.7 ; 29.4,18.95 29.41,18.95 ; 25.99,18.71 26.03,18.7
GND: length 31.4
  Top Layer w0.152: 15.13,10.55 QMC.11 ; 15.28,10.61 15.28,10.61 ; 15.37,10.73 15.37,10.73 ; 15.21,10.57 15.2,10.56 ; QMC.9 14.99,11.55 ; 15.36,11.31 15.35,11.32 ; 15.22,11.47 15.21,11.48 ; 15.36,10.7 15.35,10.69 ; 15.31,11.39 15.25,11.45 ; 15.37,11.27 15.37,11.28 ; 15.04,11.55 15.05,11.55 ; 15.18,11.5 15.17,11.51 ; 15.2,10.56 15.19,10.56 ; 15.35,11.34 15.34,11.35 ; 15.15,10.55 15.13,10.55 ; 15.37,10.72 15.36,10.72 ; 15.16,11.52 15.14,11.52 ; 15.01,11.55 15.03,11.55 ; 15.35,10.68 15.35,10.68 ; C13.2 8.53,27.58 ; 15.35,10.69 15.35,10.68 ; 15.36,11.3 15.36,11.31 ; 15.08,11.54 15.07,11.54 ; 15.27,10.6 15.26,10.6 ; 15.33,10.66 15.29,10.62 ; 8.54,27.59 8.53,27.58 ; 15.2,11.49 15.19,11.5 ; 15.36,10.72 15.36,10.71 ; C12.2 8.51,18.44 ; 15.35,11.33 15.35,11.33 ; 15.23,11.46 15.24,11.46 ; 15.23,10.57 15.22,10.57 ; 15.33,11.36 15.32,11.37 ; 15.13,11.53 15.12,11.53 ; 15.24,10.58 15.24,10.58 ; 15.36,10.71 15.36,10.7 ; 15.37,10.74 15.37,10.74 ; 15.18,10.56 15.17,10.55 ; 15.16,10.55 15.15,10.55 ; 15.37,10.75 15.37,11.25 ; 15.26,10.59 15.25,10.59 ; 15.34,10.67 15.34,10.67 ; 15.34,11.35 15.33,11.36 ; 15.34,10.67 15.33,10.66 ; 15.11,11.53 15.09,11.54 ; 15.36,11.28 15.36,11.29 ; 15.37,11.26 15.37,11.26 ; 15.32,11.38 15.31,11.38
  Top Layer w0.203: 14.87,14.63 14.88,14.64 ; 14.9,14.67 14.9,14.68 ; 14.89,14.66 14.9,14.67 ; 14.85,14.57 14.85,14.57 ; 14.85,14.58 14.85,14.59 ; 14.86,14.6 14.86,14.61 ; C10.1 14.85,14.52 ; STM32F405R.18 15.33,15.42 15.33,15.37 15.33,15.34 15.32,15.29 15.31,15.25 15.31,15.23 15.29,15.19 15.28,15.14 15.27,15.12 15.25,15.08 15.25,15.07 15.23,15.03 15.22,15.02 15.19,14.97 15.16,14.94 15.15,14.93 15.11,14.89 14.91,14.68 ; 14.88,14.64 14.88,14.65 ; 14.86,14.61 14.87,14.62 ; 14.85,14.55 14.85,14.56 ; 14.85,14.53 14.85,14.54
  Top Layer w0.249: 14.47,10.55 14.51,10.55 QMC.11 ; 13.51,9.81 14.06,10.36 14.1,10.39 ; 14.11,10.4 14.14,10.43 14.15,10.44 14.18,10.46 14.19,10.46 14.22,10.48 14.24,10.49 14.27,10.5 14.28,10.51 14.33,10.52 14.37,10.53 14.41,10.54 14.45,10.55 ; 13.46,9.72 13.47,9.72 ; 13.5,9.8 13.51,9.81 ; 13.48,9.77 13.49,9.78 ; 13.5,9.79 13.5,9.8 ; C2.2 13.46,9.68 ; 13.48,9.76 13.48,9.76 ; 13.46,9.69 13.46,9.7 ; 13.47,9.74 13.47,9.75 ; 13.46,9.7 13.46,9.71 ; 13.49,9.78 13.49,9.79 ; 13.47,9.73 13.47,9.74
  Top Layer w0.559: 10.08,18.52 10.05,18.5 10.02,18.49 10.01,18.48 9.97,18.47 9.93,18.46 9.9,18.45 9.86,18.44 ; 10.17,18.58 10.19,18.6 10.38,18.79 10.43,18.84 10.48,18.9 10.49,18.92 10.52,18.97 10.53,18.98 10.56,19.03 10.57,19.05 10.59,19.1 10.6,19.12 10.62,19.18 10.62,19.19 10.64,19.25 10.64,19.27 10.66,19.32 10.66,19.34 10.66,19.4 10.67,19.42 10.67,19.49 10.67,21.12 10.67,21.16 ; 11.04,21.71 11.05,21.72 ; 8.21,27.58 8.24,27.59 v2(8.98,27.59) 9.63,27.59 9.68,27.58 9.69,27.58 9.73,27.58 9.75,27.58 9.78,27.57 9.85,27.55 9.88,27.54 9.9,27.53 9.94,27.51 9.97,27.49 10.01,27.47 10.03,27.46 10.06,27.43 10.07,27.42 10.1,27.39 10.33,27.16 10.38,27.11 10.4,27.09 10.44,27.04 10.45,27.02 10.46,27 10.49,26.96 10.5,26.94 10.53,26.88 10.55,26.86 10.57,26.8 10.59,26.77 10.6,26.72 10.62,26.69 10.63,26.63 10.64,26.6 10.65,26.55 10.65,26.53 10.66,26.51 10.66,26.46 10.66,26.43 10.67,26.35 v2(10.67,25.74) 10.67,24.91 10.67,24.87 ; 10.82,21.51 10.84,21.53 10.95,21.64 ; 10.96,21.65 10.97,21.66 ; 11.14,21.74 11.15,21.74 ; 10.1,18.53 10.12,18.54 10.15,18.56 ; 10.98,21.67 10.99,21.68 ; 7.88,18.57 7.9,18.55 7.94,18.53 7.95,18.52 7.98,18.5 7.99,18.5 8.02,18.49 8.03,18.48 8.07,18.47 8.09,18.46 8.11,18.46 8.14,18.45 8.18,18.44 ; 11.02,21.7 11.03,21.7 ; 10.8,21.5 10.78,21.47 10.78,21.46 10.75,21.42 10.73,21.38 10.71,21.34 10.7,21.3 10.69,21.27 10.68,21.25 10.67,21.2 10.67,21.18 ; 11.11,21.74 11.12,21.74 ; 8.19,18.44 8.23,18.44 9.81,18.44 9.84,18.44 ; 8.19,27.58 8.15,27.58 8.11,27.57 8.06,27.56 8.02,27.54 7.98,27.53 7.97,27.52 7.94,27.5 7.9,27.47 7.87,27.45 ; 11.18,21.74 v2(11.68,21.74) ; 10.99,24.35 10.98,24.36 ; 11.06,24.31 11.04,24.32 ; 11.03,24.32 11.02,24.33 ; 10.97,24.36 10.96,24.37 ; 11.08,24.3 11.07,24.31 ; 7.86,27.44 v2(7.84,27.42) 7.83,27.41 7.57,27.16 7.53,27.11 7.51,27.09 7.47,27.04 7.46,27.02 7.45,27 7.42,26.96 7.41,26.94 7.37,26.88 7.36,26.86 7.33,26.8 7.32,26.77 7.3,26.72 7.29,26.69 7.28,26.63 7.27,26.6 7.26,26.55 7.25,26.53 7.25,26.51 7.24,26.46 7.24,26.43 7.24,26.35 v2(7.24,25.74) v2(7.24,24.67) v2(7.24,23.59) v2(7.24,22.51) v2(7.24,21.55) 7.24,19.59 7.24,19.52 7.24,19.5 7.25,19.45 7.25,19.43 7.26,19.38 7.27,19.36 7.28,19.31 7.29,19.29 7.31,19.24 7.31,19.22 7.34,19.17 7.35,19.16 7.37,19.11 7.38,19.09 7.41,19.05 7.42,19.03 7.46,18.99 7.47,18.98 7.51,18.93 7.84,18.6 7.86,18.58 ; 11.16,21.74 11.18,21.74 ; 11.16,24.28 11.18,24.28 ; 11.13,24.29 11.12,24.29 ; 10.95,24.38 10.84,24.49 10.81,24.52 ; 11.01,24.33 11,24.34 ; 11.09,21.73 11.1,21.73 ; 11.15,24.29 11.14,24.29 ; 10.8,24.54 10.78,24.56 10.75,24.61 10.73,24.64 10.71,24.69 10.7,24.72 10.69,24.76 10.68,24.78 10.67,24.83 10.67,24.85 ; 11.18,24.28 v2(11.68,24.28) ; 11,21.69 11.01,21.69 ; 11.06,21.72 11.08,21.73 ; 11.1,24.29 11.09,24.3
  Bottom Layer w0.254: C21.1 24.85,28.4 ; 24.78,28.46 24.77,28.47 ; 21.65,28.55 21.67,28.54 ; 24.83,28.42 24.83,28.43 ; 24.76,28.48 24.74,28.49 ; 21.37,28.64 21.39,28.63 ; C22.1 21.21,28.77 ; 21.77,28.54 24.52,28.54 ; 21.33,28.67 21.34,28.66 ; 24.81,28.44 24.8,28.45 ; 21.48,28.59 21.5,28.58 ; 21.43,28.61 21.45,28.6 ; 21.59,28.56 21.61,28.55 ; 24.56,28.54 24.56,28.54 ; 24.66,28.52 24.65,28.52 ; 24.69,28.51 24.68,28.51 ; 21.28,28.71 21.3,28.69 ; 24.73,28.5 24.71,28.5 ; 21.54,28.57 21.56,28.56 ; 24.6,28.53 24.58,28.54 ; 21.73,28.54 21.71,28.54 ; 21.24,28.74 21.25,28.73 ; 24.63,28.53 24.62,28.53
  vias: v2(1.69,27.91) v2(1.69,17.06) v2(3.51,22.49) v2(3.51,21.8) v2(4.03,13.05) v2(4.11,22.15) v2(4.52,9.74) v2(4.52,9.05) v2(4.52,8.36) v2(4.52,7.68) v2(4.52,6.99) v2(4.63,13.39) v2(4.63,12.7) v2(5.12,10.09) v2(5.12,9.4) v2(5.12,8.71) v2(5.12,8.02) v2(5.12,7.33) v2(5.12,6.64) v2(5.72,9.74) v2(5.72,9.06) v2(5.72,8.37) v2(7.24,26.82) v2(10.06,27.43) v2(10.67,26.82) v2(10.67,24.67) v2(10.84,21.54) v2(22.62,37.29) v2(22.97,36.69) v2(23.31,37.29) v2(23.66,36.69) v2(24,37.29) v2(24.35,36.69) v2(24.56,3.33) v2(24.69,37.29) v2(25.03,36.69) v2(25.25,3.33) v2(25.38,37.29) v2(25.6,0.79) v2(25.94,1.39) v2(26.29,0.79) v2(26.63,1.39) v2(26.98,0.79) v2(27.32,1.39) v2(27.67,0.79) v2(28.22,7.9) v2(28.22,7.21) v2(28.22,6.53) v2(28.22,5.84) v2(28.22,5.15) v2(28.22,4.46) v2(28.22,3.77) v2(34.87,27.51) v2(34.87,26.82) v2(34.87,26.13) v2(34.87,18.8) v2(34.87,18.11) v2(34.87,17.42) v2(34.87,16.74) v2(34.87,16.05) v2(35.47,27.86) v2(35.47,27.17) v2(35.47,26.48) v2(35.47,25.79) v2(35.47,19.15) v2(35.47,18.46) v2(35.47,17.77) v2(35.47,17.08) v2(35.47,16.39) v2(35.47,15.7) v2(36.07,27.51) v2(36.07,26.82) v2(36.07,26.14) v2(36.07,18.8) v2(36.07,18.12) v2(36.07,17.43) v2(36.07,16.74) v2(36.07,16.05) v3(5.1,31.17) v3(6,32.08) v3(6,31.17) v3(6,30.28) v3(6.69,35.88) v3(6.69,34.92) v3(6.69,33.95) v3(6.9,33.01) v3(6.9,32.18) v3(6.9,31.36) v3(6.9,30.53) v3(7.03,29.7) v3(7.52,35.42) v3(7.52,34.52) v3(7.52,33.62) v3(8.35,34.52) v3(8.35,33.62) v3(9.18,33.62) v3(10,33.62) v3(10.49,29.7) v3(10.62,33.01) v3(10.62,32.18) v3(10.62,31.36) v3(10.62,30.53) v3(11.52,32.33) v3(11.52,31.43) v3(11.52,30.53) v3(12.42,32.58) v3(12.42,31.68) v3(12.42,30.78) v3(13.32,32.33) v3(13.32,31.43) v3(13.32,30.53) v3(14.22,32.58) v3(14.22,31.68) v3(14.22,30.78) v3(15.12,32.33) v3(15.12,31.43) v3(15.12,30.53) v3(28.11,11.24) v4(5.59,18.19) v4(5.79,16.64) v4(6.17,15.08) v4(6.75,15.08) v4(7.17,17.25) v4(7.17,16.67) v4(8.05,36.7) v4(9.18,5.08) v4(9.18,4.51) v4(9.69,5.38) v4(9.69,4.8) v4(9.69,4.22) v4(10.19,5.09) v4(10.19,4.51) v4(10.58,12.96) v4(10.58,12.38) v4(10.79,15.78) v4(10.83,11.83) v4(10.79,10.58) v4(10.79,10) v4(10.79,9.42) v4(10.79,8.85) v4(11.2,13.42) v4(11.37,15.78) v4(11.95,15.78) v4(12.71,9.59) v4(12.71,9.01) v4(12.71,8.43) v4(13.21,9.3) v4(13.21,8.72) v4(13.46,13.76) v4(13.71,9.59) v4(13.71,9.01) v4(13.71,8.43) v4(13.74,5.98) v4(13.74,5.4) v4(13.81,15.04) v4(13.81,14.46) v4(14.21,8.72) v4(14.24,6.27) v4(14.24,5.69) v4(14.24,5.11) v4(14.31,14.75) v4(14.75,5.98) v4(14.75,5.4) v4(15.22,25.92) v4(15.62,22.12) v4(15.72,25.63) v4(16.12,22.42) v4(16.12,21.84) v4(16.22,25.92) v4(16.22,25.34) v4(16.22,24.76) v4(16.22,24.18) v4(16.63,22.13) v4(16.63,21.55) v4(16.72,25.63) v4(16.72,25.05) v4(16.72,24.47) v4(16.72,23.89) v4(16.95,29.46) v4(17.68,28.53) v4(17.98,6.48) v4(18.16,11.41) v4(18.53,4.83) v4(18.53,4.25) v4(18.66,11.7) v4(18.83,36.68) v4(18.83,36.1) v4(18.83,35.52) v4(18.83,34.94) v4(18.83,34.36) v4(18.83,33.78) v4(18.83,33.2) v4(18.83,32.62) v4(18.83,32.04) v4(18.89,22.13) v4(18.89,21.55) v4(18.89,20.97) v4(18.89,20.39) v4(19.03,4.54) v4(19.33,36.97) v4(19.33,36.39) v4(19.33,35.81) v4(19.33,35.23) v4(19.33,34.65) v4(19.33,34.07) v4(19.33,33.49) v4(19.33,32.91) v4(19.33,32.33) v4(19.39,21.84) v4(19.39,21.26) v4(19.39,20.69) v4(19.55,9.39) v4(19.55,8.81) v4(19.83,36.68) v4(19.83,36.1) v4(19.83,33.78) v4(19.83,33.21) v4(19.83,32.63) v4(19.97,6.83) v4(20.13,9.39) v4(20.47,7.12) v4(20.47,6.54) v4(20.59,14.58) v4(20.66,20.69) v4(20.66,20.11) v4(20.79,25.55) v4(20.79,24.97) v4(20.79,24.39) v4(20.97,7.41) v4(20.97,6.83) v4(20.97,6.25) v4(21.16,20.4) v4(21.29,25.26) v4(21.29,24.68) v4(21.29,24.1) v4(21.29,23.52) v4(21.51,10.11) v4(21.47,7.7) v4(21.47,7.12) v4(21.47,6.55) v4(21.79,24.97) v4(21.79,24.39) v4(21.79,23.81) v4(21.79,23.24) v4(21.98,7.42) v4(21.98,6.84) v4(21.98,6.26) v4(22.18,13.63) v4(22.3,24.69) v4(22.3,24.11) v4(22.3,23.53) v4(22.63,13.19) v4(24.51,12.6) v4(24.51,11.33) v4(25.15,12.6) v4(25.15,11.33) v4(25.49,13.86) v4(25.71,14.45) v4(27.54,25.84) v4(27.54,25.26) v4(27.54,24.69) v4(30.2,36.57) v4(30.2,35.99) v4(30.7,36.28) v5(22.89,15.81)
